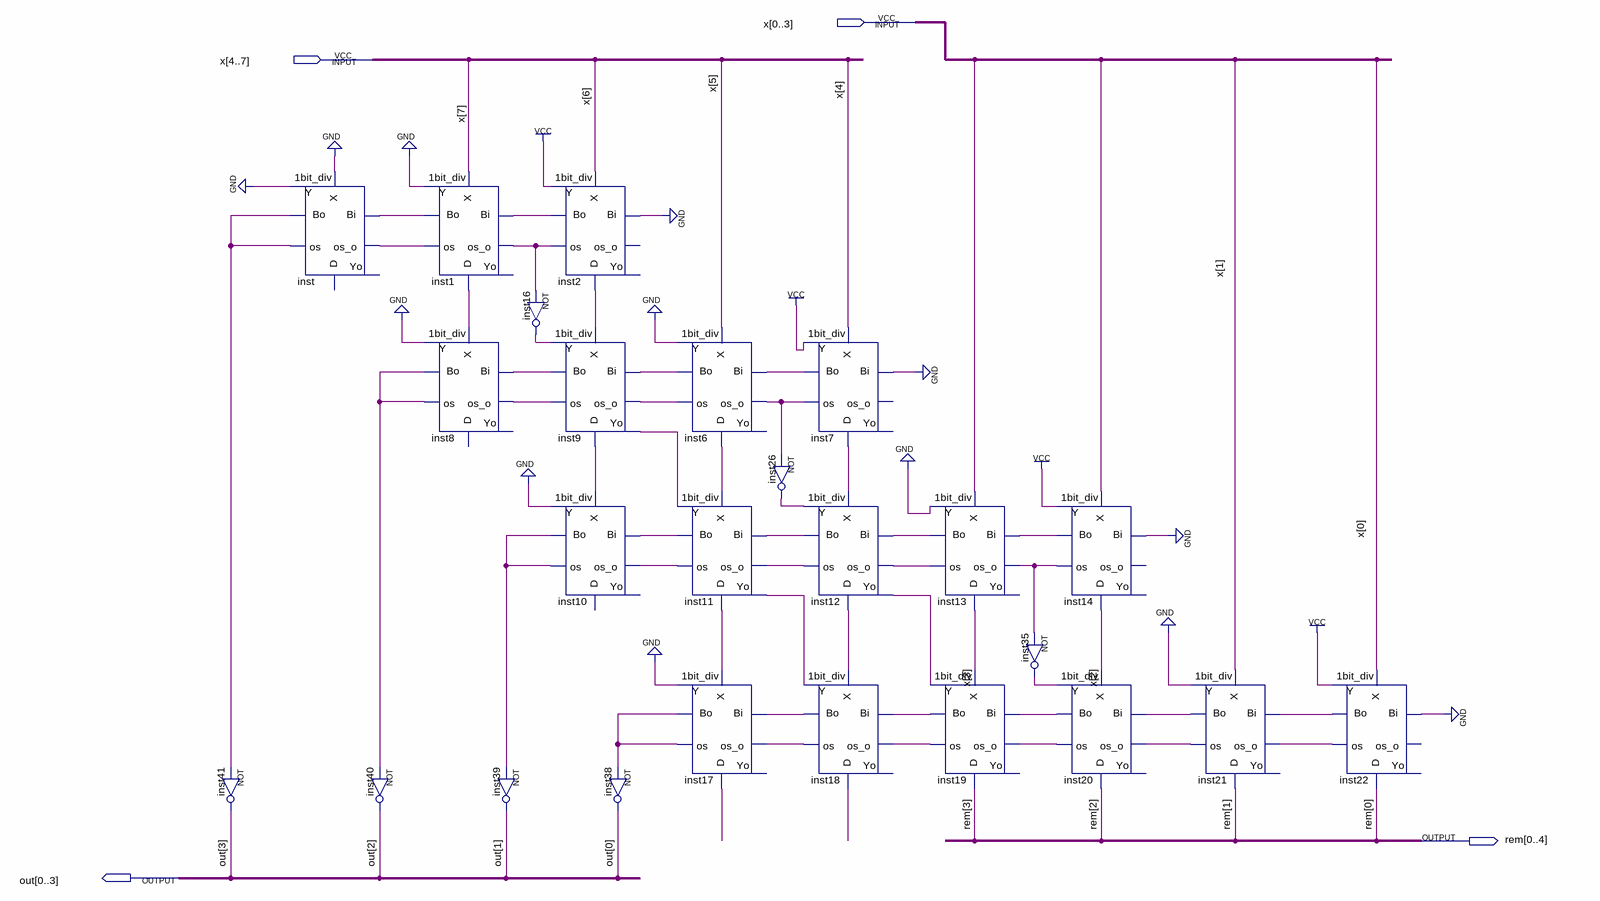
[diagram p0: schematic sheet]
// Quartus schematic 8bit_sqrt.bdf as structural Verilog: 25 symbols, 4 pins
module \8bit_sqrt  (
  input  [0:7] x,
  output [0:4] rem,
  output [0:3] out
);

  wire inst1_bo, inst1_d, inst1_os_o, inst2_bo, inst2_d, inst6_bo, inst6_d, inst6_os_o, inst7_bo, inst7_d,
       inst8_bo, inst8_os_o, inst9_bo, inst9_d, inst9_os_o, inst9_yo, inst10_bo, inst10_os_o, inst11_bo,
       inst11_d, inst11_os_o, inst11_yo, inst12_bo, inst12_d, inst12_os_o, inst12_yo, inst13_bo, inst13_d,
       inst13_os_o, inst14_bo, inst14_d, inst16_out, inst17_bo, inst17_d, inst17_os_o, inst18_bo, inst18_d,
       inst18_os_o, inst19_bo, inst19_os_o, inst20_bo, inst20_os_o, inst21_bo, inst21_os_o, inst22_bo,
       inst26_out, inst35_out, inst_bo, inst_os_o;

  not inst41 (out[3], inst_bo);
  \1bit_div  inst (.Y(1'b0), .X(1'b0), .Bi(inst1_bo), .os(inst_bo), .Bo(inst_bo), .os_o(inst_os_o));  // open: Yo, D
  not inst40 (out[2], inst8_bo);
  \1bit_div  inst1 (
    .Y(1'b0), .X(x[7]), .Bi(inst2_bo), .os(inst_os_o), .Bo(inst1_bo), .os_o(inst1_os_o), .D(inst1_d));  // open: Yo
  \1bit_div  inst8 (
    .Y(1'b0), .X(inst1_d), .Bi(inst9_bo), .os(inst8_bo), .Bo(inst8_bo), .os_o(inst8_os_o));  // open: Yo, D
  not inst39 (out[1], inst10_bo);
  \1bit_div  inst2 (.Y(1'b1), .X(x[6]), .Bi(1'b0), .os(inst1_os_o), .Bo(inst2_bo), .D(inst2_d));  // open: Yo, os_o
  not inst16 (inst16_out, inst1_os_o);
  \1bit_div  inst9 (
    .Y(inst16_out), .X(inst2_d), .Bi(inst6_bo), .os(inst8_os_o), .Yo(inst9_yo), .Bo(inst9_bo),
    .os_o(inst9_os_o), .D(inst9_d));
  \1bit_div  inst10 (
    .Y(1'b0), .X(inst9_d), .Bi(inst11_bo), .os(inst10_bo), .Bo(inst10_bo), .os_o(inst10_os_o));  // open: Yo, D
  not inst38 (out[0], inst17_bo);
  \1bit_div  inst6 (
    .Y(1'b0), .X(x[5]), .Bi(inst7_bo), .os(inst9_os_o), .Bo(inst6_bo), .os_o(inst6_os_o), .D(inst6_d));  // open: Yo
  \1bit_div  inst11 (
    .Y(inst9_yo), .X(inst6_d), .Bi(inst12_bo), .os(inst10_os_o), .Yo(inst11_yo), .Bo(inst11_bo),
    .os_o(inst11_os_o), .D(inst11_d));
  \1bit_div  inst17 (
    .Y(1'b0), .X(inst11_d), .Bi(inst18_bo), .os(inst17_bo), .Bo(inst17_bo), .os_o(inst17_os_o), .D(inst17_d));  // open: Yo
  \1bit_div  inst7 (.Y(1'b1), .X(x[4]), .Bi(1'b0), .os(inst6_os_o), .Bo(inst7_bo), .D(inst7_d));  // open: Yo, os_o
  not inst26 (inst26_out, inst6_os_o);
  \1bit_div  inst12 (
    .Y(inst26_out), .X(inst7_d), .Bi(inst13_bo), .os(inst11_os_o), .Yo(inst12_yo), .Bo(inst12_bo),
    .os_o(inst12_os_o), .D(inst12_d));
  \1bit_div  inst18 (
    .Y(inst11_yo), .X(inst12_d), .Bi(inst19_bo), .os(inst17_os_o), .Bo(inst18_bo), .os_o(inst18_os_o),
    .D(inst18_d));  // open: Yo
  \1bit_div  inst13 (
    .Y(1'b0), .X(x[3]), .Bi(inst14_bo), .os(inst12_os_o), .Bo(inst13_bo), .os_o(inst13_os_o), .D(inst13_d));  // open: Yo
  \1bit_div  inst19 (
    .Y(inst12_yo), .X(inst13_d), .Bi(inst20_bo), .os(inst18_os_o), .Bo(inst19_bo), .os_o(inst19_os_o),
    .D(rem[3]));  // open: Yo
  not inst35 (inst35_out, inst13_os_o);
  \1bit_div  inst14 (.Y(1'b1), .X(x[2]), .Bi(1'b0), .os(inst13_os_o), .Bo(inst14_bo), .D(inst14_d));  // open: Yo, os_o
  \1bit_div  inst20 (
    .Y(inst35_out), .X(inst14_d), .Bi(inst21_bo), .os(inst19_os_o), .Bo(inst20_bo), .os_o(inst20_os_o),
    .D(rem[2]));  // open: Yo
  \1bit_div  inst21 (
    .Y(1'b0), .X(x[1]), .Bi(inst22_bo), .os(inst20_os_o), .Bo(inst21_bo), .os_o(inst21_os_o), .D(rem[1]));  // open: Yo
  \1bit_div  inst22 (.Y(1'b1), .X(x[0]), .Bi(1'b0), .os(inst21_os_o), .Bo(inst22_bo), .D(rem[0]));  // open: Yo, os_o
endmodule
